# Altium schematic sheet 51-2001-01-2_04 Power Module Schematic.SchDoc
size 431 x 279 mm; Organization: ORGANIZATION; Address1: ADDRESS 1; Address2: ADDRESS 2; Address3: ADDRESS 3; Address4: ADDRESS 4; Revision: -; SheetNumber: 4; SheetTotal: 4; ENG_APP_DATE: --/--/--; DSN_APP_DATE: --/--/--; CHK_APP_DATE: --/--/--
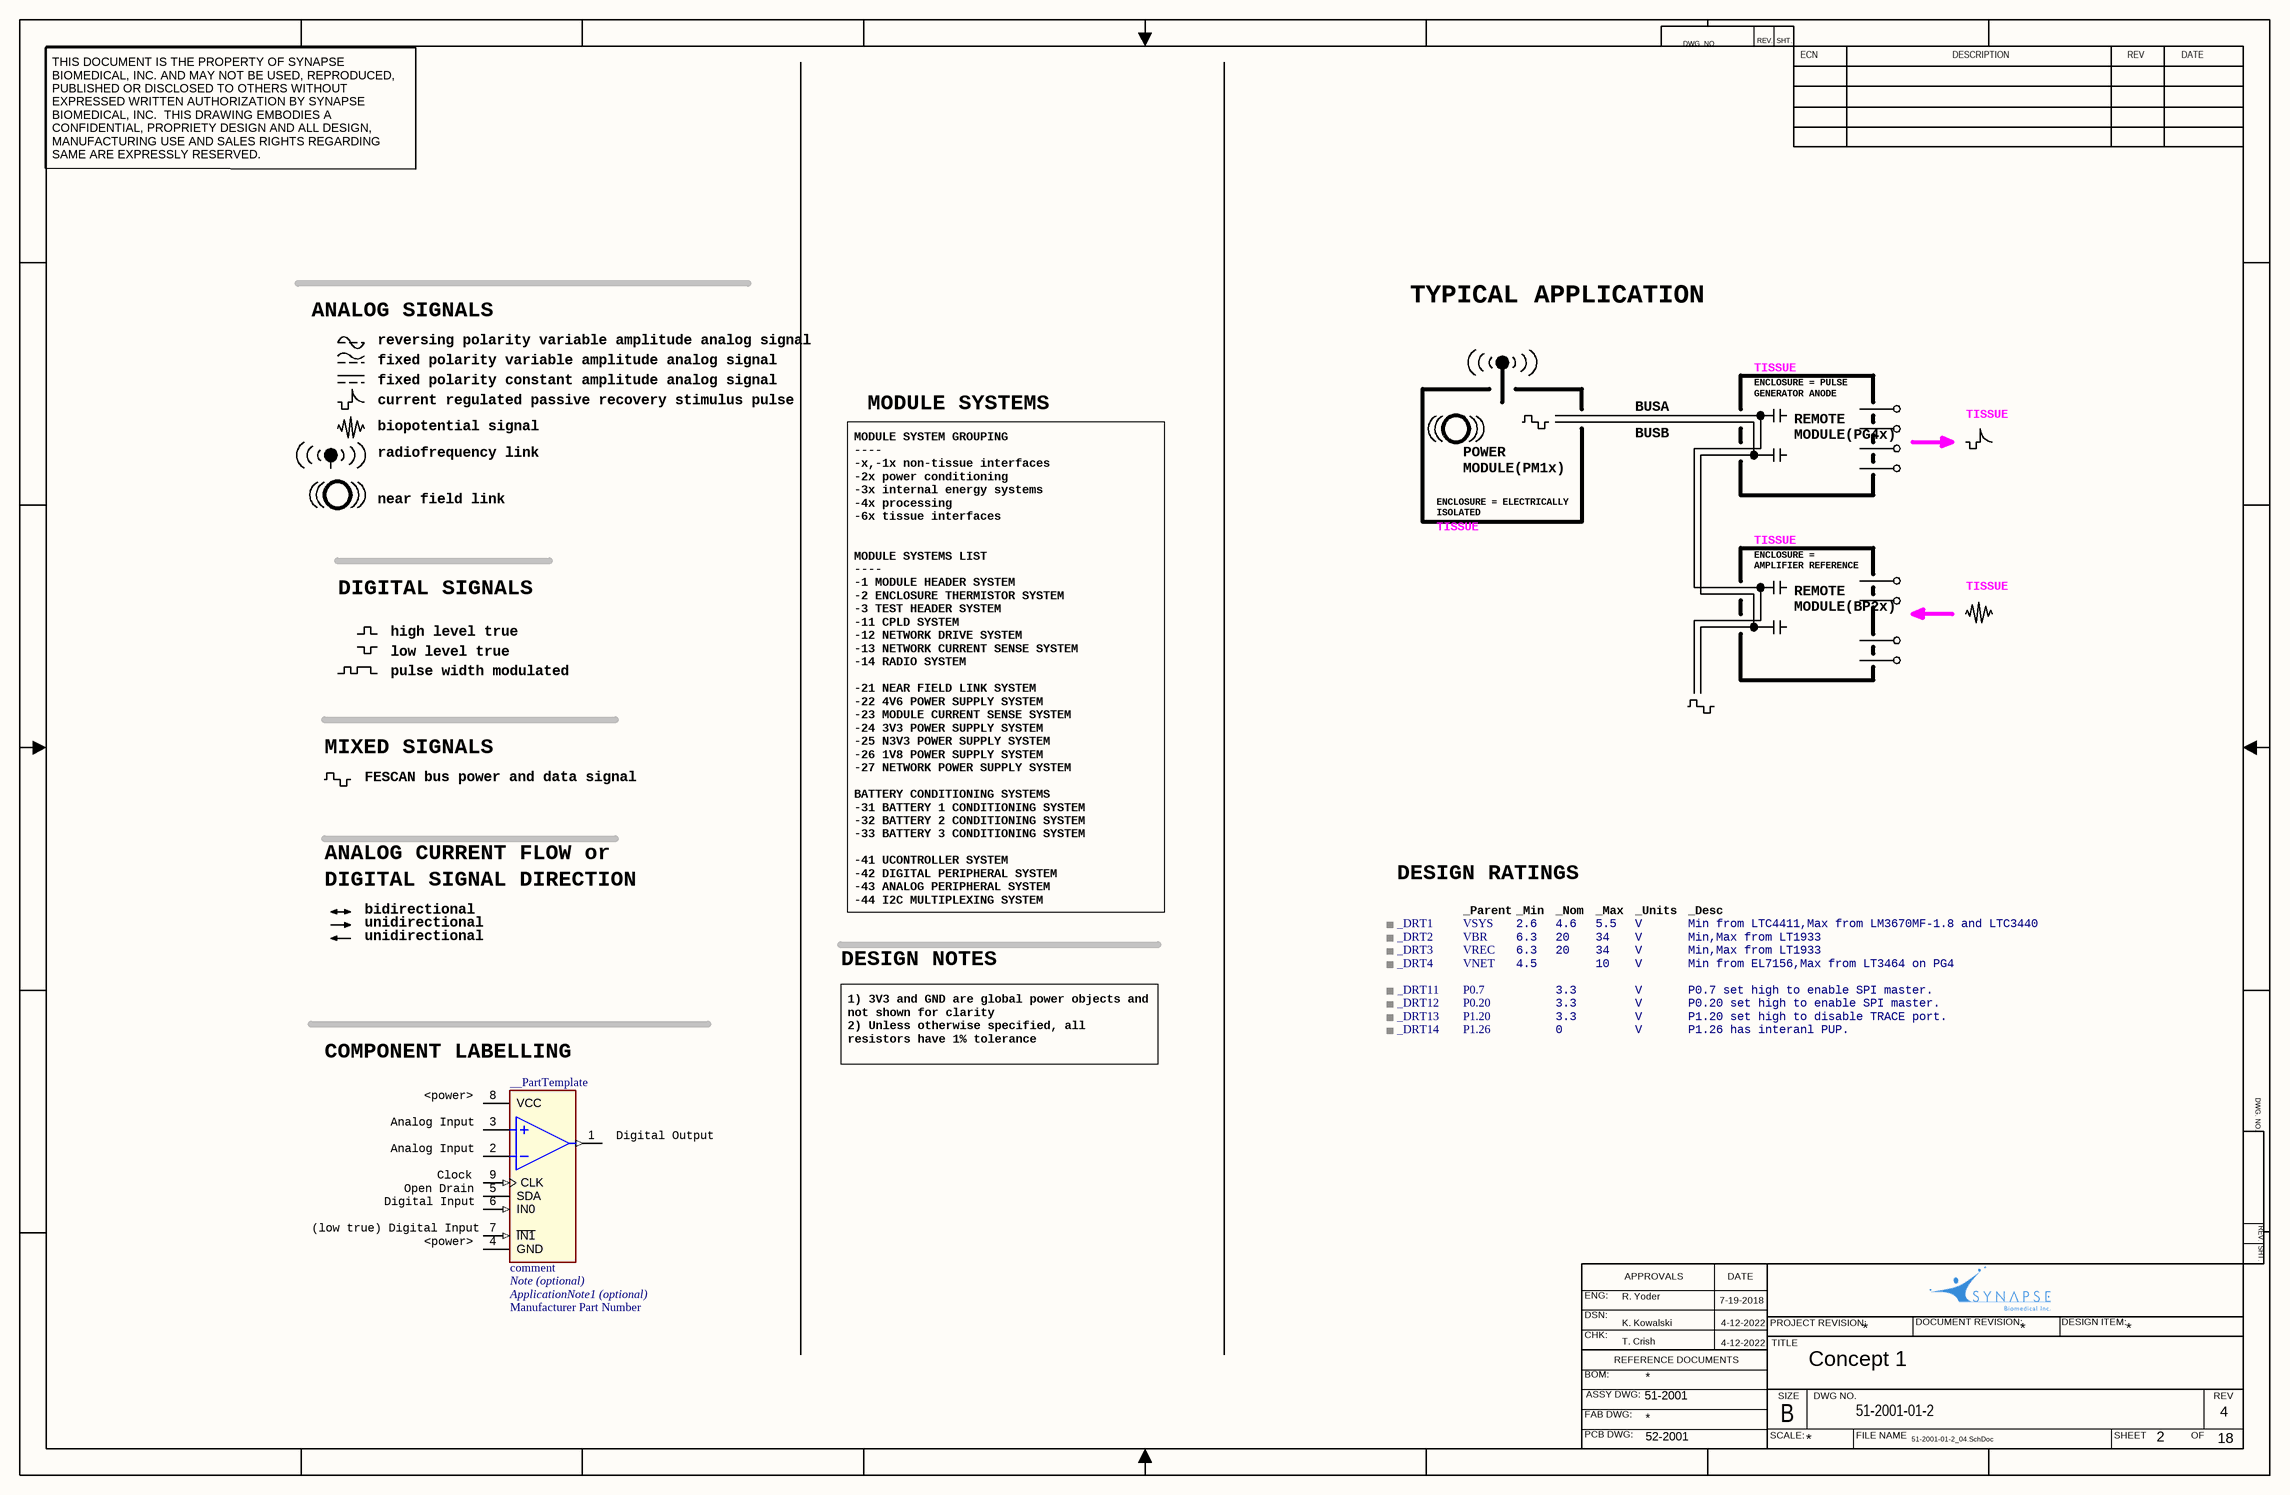
[diagram p0: 51-2001-01-2_04 Power Module Schematic.SchDoc]

## Parts
__PartTemplate  comment  Note: Note (optional)  AN1: ApplicationNote1 (optional)  MPN: Manufacturer Part Number  (graphical)
_DRT1  _Desc: Min from LTC4411,Max from LM3670MF-1.8 and LTC3440  _Units: V  _Min: 2.6  _Nom: 4.6  _Max: 5.5  _Parent: VSYS  (hidden comment: DRT4)  (graphical)
_DRT2  _Desc: Min,Max from LT1933  _Units: V  _Min: 6.3  _Nom: 20  _Max: 34  _Parent: VBR  (hidden comment: DRT4)  (graphical)
_DRT3  _Desc: Min,Max from LT1933  _Units: V  _Min: 6.3  _Nom: 20  _Max: 34  _Parent: VREC  (hidden comment: DRT4)  (graphical)
_DRT4  _Desc: Min from EL7156,Max from LT3464 on PG4  _Units: V  _Min: 4.5  _Max: 10  _Parent: VNET  (hidden comment: DRT4)  (graphical)
_DRT11  _Desc: P0.7 set high to enable SPI master.  _Units: V  _Nom: 3.3  _Parent: P0.7  (hidden comment: DRT4)  (graphical)
_DRT12  _Desc: P0.20 set high to enable SPI master.  _Units: V  _Nom: 3.3  _Parent: P0.20  (hidden comment: DRT4)  (graphical)
_DRT13  _Desc: P1.20 set high to disable TRACE port.  _Units: V  _Nom: 3.3  _Parent: P1.20  (hidden comment: DRT4)  (graphical)
_DRT14  _Desc: P1.26 has interanl PUP.  _Units: V  _Nom: 0  _Parent: P1.26  (hidden comment: DRT4)  (graphical)

## Nets

Not connected (* = marked no-connect by the designer): __PartTemplate 1(OUTA) 2(INA-) 3(AIN) 4(GND) 5(SDA) 6(IN0) 7(~{IN1}) 8(VCC) 9(CLK)

## Notes on the sheet
- DWG. NO.
- REV.
- SHT.
- ECN
- DESCRIPTION
- REV
- DATE
- THIS DOCUMENT IS THE PROPERTY OF SYNAPSE BIOMEDICAL, INC. AND MAY NOT BE USED, REPRODUCED, PUBLISHED OR DISCLOSED TO OTHERS WITHOUT EXPRESSED WRITTEN AUTHORIZATION BY SYNAPSE BIOMEDICAL, INC.  THIS DRAWING EMBODIES A CONFIDENTIAL, PROPRIETY DESIGN AND ALL DESIGN, MANUFACTURING USE AND SALES RIGHTS REGARDING SAME ARE EXPRESSLY RESERVED.
- TYPICAL APPLICATION
- ANALOG SIGNALS
- fixed polarity variable amplitude analog signal
- reversing polarity variable amplitude analog signal
- TISSUE
- fixed polarity constant amplitude analog signal
- current regulated passive recovery stimulus pulse
- biopotential signal
- MODULE SYSTEMS
- BUSA
- BUSB
- ENCLOSURE = PULSE GENERATOR ANODE
- radiofrequency link
- near field link
- POWER MODULE(PM1x)
- REMOTE MODULE(PG4x)
- ENCLOSURE = ELECTRICALLY ISOLATED
- ENCLOSURE = AMPLIFIER REFERENCE
- DIGITAL SIGNALS
- high level true
- REMOTE MODULE(BP2x)
- low level true
- pulse width modulated
- MIXED SIGNALS
- FESCAN bus power and data signal
- ANALOG CURRENT FLOW or
- DIGITAL SIGNAL DIRECTION
- MODULE SYSTEM GROUPING
  ----
  -x,-1x non-tissue interfaces
  -2x power conditioning
  -3x internal energy systems
  -4x processing
  -6x tissue interfaces
  MODULE SYSTEMS LIST
  ----
  -1 MODULE HEADER SYSTEM
  -2 ENCLOSURE THERMISTOR SYSTEM
  -3 TEST HEADER SYSTEM
  -11 CPLD SYSTEM
  -12 NETWORK DRIVE SYSTEM
  -13 NETWORK CURRENT SENSE SYSTEM
  -14 RADIO SYSTEM
  -21 NEAR FIELD LINK SYSTEM
  -22 4V6 POWER SUPPLY SYSTEM
  -23 MODULE CURRENT SENSE SYSTEM
  -24 3V3 POWER SUPPLY SYSTEM
  -25 N3V3 POWER SUPPLY SYSTEM
  -26 1V8 POWER SUPPLY SYSTEM
  -27 NETWORK POWER SUPPLY SYSTEM
  BATTERY CONDITIONING SYSTEMS
  -31 BATTERY 1 CONDITIONING SYSTEM
  -32 BATTERY 2 CONDITIONING SYSTEM
  -33 BATTERY 3 CONDITIONING SYSTEM
  -41 UCONTROLLER SYSTEM
  -42 DIGITAL PERIPHERAL SYSTEM
  -43 ANALOG PERIPHERAL SYSTEM
  -44 I2C MULTIPLEXING SYSTEM
- DESIGN RATINGS
- bidirectional
- unidirectional
- DESIGN NOTES
- _Parent
- _Min
- _Nom
- _Max
- _Units
- _Desc
- (near __PartTemplate) COMPONENT LABELLING
- 1) 3V3 and GND are global power objects and not shown for clarity
  2) Unless otherwise specified, all resistors have 1% tolerance
- ENG:
- R. Yoder
- APPROVALS
- 7-19-2018
- DSN:
- CHK:
- REFERENCE DOCUMENTS
- K. Kowalski
- T. Crish
- 4-12-2022
- PROJECT REVISION:
- TITLE
- Concept 1
- *
- DOCUMENT REVISION:
- DESIGN ITEM:
- BOM:
- FAB DWG:
- PCB DWG:
- ASSY DWG:
- 51-2001
- SCALE:
- SIZE
- B
- DWG NO.
- 51-2001-01-2
- FILE NAME
- SHEET
- OF
- 4
- 52-2001
- 51-2001-01-2_04.SchDoc
- 2
- 18
- (in symbol __PartTemplate) <power>; Analog Input; Digital Output; Clock; Open Drain; Digital Input; (low true) Digital Input

## Library data of the parts
__PartTemplate = __PartTemplate: MFR: Manufacturer
_DRT1-_DRT4 _DRT11-_DRT14 = DRT4: Design rating